# Altium project Wearables.PrjPcb
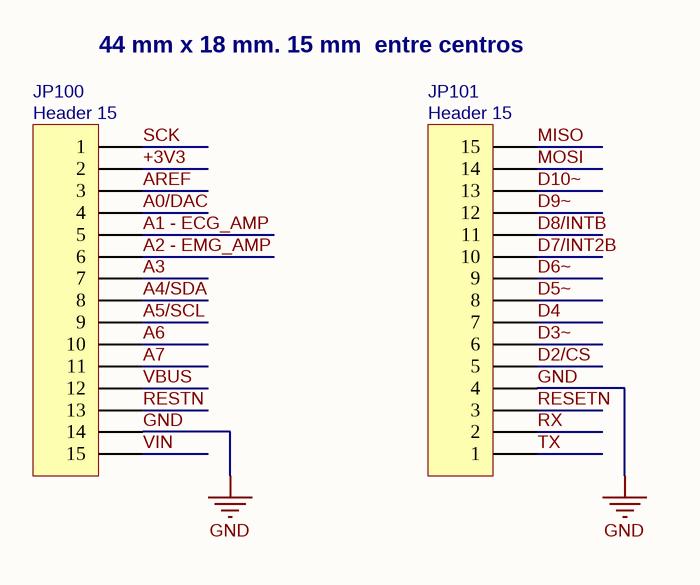
[diagram p0: Connectors.SchDoc]
5 sheets, 86 parts. Net scope: global (net labels, ports and power ports of the same name join across sheets).
Sheets:
  Connectors.SchDoc
  Power supply.SchDoc
  ECG_Chip.SchDoc
  EMG Amplifier.SchDoc
  Sensores.SchDoc

## Sheet Connectors.SchDoc
size A4; Organization: Altium Limited; Address1: 3 Minna Close; Address2: Belrose; Address3: NSW 2085; Address4: Australia

### Parts
JP100  Header 15  [HDR1X15]
JP101  Header 15  [HDR1X15]

### Nets
+3V3: JP100.2
GND: JP100.14 JP101.4
A0/DAC: JP100.4
A1 - ECG_AMP: JP100.5
A2 - EMG_AMP: JP100.6
A3: JP100.7
A4/SDA: JP100.8
A5/SCL: JP100.9
A6: JP100.10
A7: JP100.11
AREF: JP100.3
D2/CS: JP101.5
D3~: JP101.6
D4: JP101.7
D5~: JP101.8
D6~: JP101.9
D7/INT2B: JP101.10
D8/INTB: JP101.11
D9~: JP101.12
D10~: JP101.13
MISO: JP101.15
MOSI: JP101.14
RESETN: JP101.3
RESTN: JP100.13
RX: JP101.2
SCK: JP100.1
TX: JP101.1
VBUS: JP100.12
VIN: JP100.15

### Notes on the sheet
- 44 mm x 18 mm. 15 mm  entre centros
- Title
- Size:
- Date:
- A4
- Number:
- Time:
- Revision:
- Sheet
- of
- File:

### Library data of the parts
JP100 JP101 = Header 15: Header, 15-Pin; LatestRevisionDate: 17-Jul-2002; LatestRevisionNote: Re-released for DXP Platform.; Publisher: Altium Limited

## Sheet Power supply.SchDoc
size A4; Organization: Altium Limited; Address1: 3 Minna Close; Address2: Belrose; Address3: NSW 2085; Address4: Australia
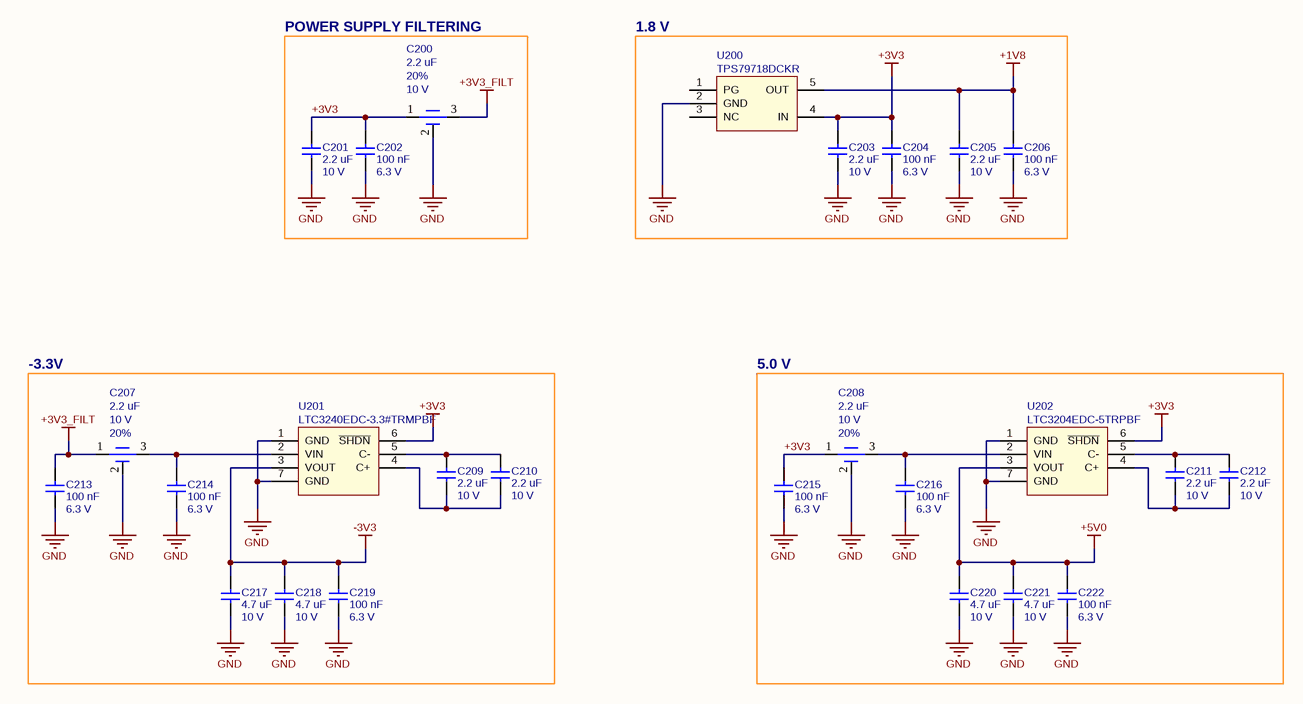
[diagram p1: Power supply.SchDoc]

### Parts
C200  value 2.2 uF  Tolerance: 20%  Voltage Max: 10 V  [NFC18PC - 0603]  (hidden comment: NFM18PC225B1A3)
C201  value 2.2 uF  Voltage Max: 10 V  [C0201]  (hidden comment: Capacitor no polarized)
C202  value 100 nF  Voltage Max: 6.3 V  [C0201]  (hidden comment: Capacitor no polarized)
C203  value 2.2 uF  Voltage Max: 10 V  [C0402]  (hidden comment: Capacitor no polarized)
C204  value 100 nF  Voltage Max: 6.3 V  [C0201]  (hidden comment: Capacitor no polarized)
C205  value 2.2 uF  Voltage Max: 10 V  [C0402]  (hidden comment: Capacitor no polarized)
C206  value 100 nF  Voltage Max: 6.3 V  [C0201]  (hidden comment: Capacitor no polarized)
C207  value 2.2 uF  Tolerance: 20%  Voltage Max: 10 V  [NFC18PC - 0603]  (hidden comment: NFM18PC225B1A3)
C208  value 2.2 uF  Tolerance: 20%  Voltage Max: 10 V  [NFC18PC - 0603]  (hidden comment: NFM18PC225B1A3)
C209  value 2.2 uF  Voltage Max: 10 V  [C0201]  (hidden comment: Capacitor no polarized)
C210  value 2.2 uF  Voltage Max: 10 V  [C0201]  (hidden comment: Capacitor no polarized)
C211  value 2.2 uF  Voltage Max: 10 V  [C0201]  (hidden comment: Capacitor no polarized)
C212  value 2.2 uF  Voltage Max: 10 V  [C0201]  (hidden comment: Capacitor no polarized)
C213  value 100 nF  Voltage Max: 6.3 V  [C0201]  (hidden comment: Capacitor no polarized)
C214  value 100 nF  Voltage Max: 6.3 V  [C0201]  (hidden comment: Capacitor no polarized)
C215  value 100 nF  Voltage Max: 6.3 V  [C0201]  (hidden comment: Capacitor no polarized)
C216  value 100 nF  Voltage Max: 6.3 V  [C0201]  (hidden comment: Capacitor no polarized)
C217  value 4.7 uF  Voltage Max: 10 V  [C0402]  (hidden comment: Capacitor no polarized)
C218  value 4.7 uF  Voltage Max: 10 V  [C0402]  (hidden comment: Capacitor no polarized)
C219  value 100 nF  Voltage Max: 6.3 V  [C0201]  (hidden comment: Capacitor no polarized)
C220  value 4.7 uF  Voltage Max: 10 V  [C0402]  (hidden comment: Capacitor no polarized)
C221  value 4.7 uF  Voltage Max: 10 V  [C0402]  (hidden comment: Capacitor no polarized)
C222  value 100 nF  Voltage Max: 6.3 V  [C0201]  (hidden comment: Capacitor no polarized)
U200  Reference: TPS79718DCKR  [5-SC70]  (hidden comment: TPS79718DCK)
U201  Reference: LTC3240EDC-3.3#TRMPBF  [DFN-6_DC]  (hidden comment: LTC3204-5)
U202  Reference: LTC3204EDC-5TRPBF  [DFN-6_DC]  (hidden comment: LTC3204-5)

### Blocks framed on the sheet
POWER SUPPLY FILTERING: C200-C202
1.8 V: C203-C206 U200
-3.3V: C207 C209 C210 C213 C214 C217-C219 U201
5.0 V: C208 C211 C212 C215 C216 C220-C222 U202

### Nets
+1V8: C205.2 C206.2 U200.5(OUT)
+3V3: C200.1(IN) C201.2 C202.2 C203.2 C204.2 C208.1(IN) C215.2 U200.4(IN) U201.6(~{SHDN}) U202.6(~{SHDN})
+3V3_FILT: C200.3(OUT) C207.1(IN) C213.2
+5V0: C220.2 C221.2 C222.2 U202.3(VOUT)
-3V3: C217.2 C218.2 C219.2 U201.3(VOUT)
GND: C200.2(GND) C201.1 C202.1 C203.1 C204.1 C205.1 C206.1 C207.2(GND) C208.2(GND) C213.1 C214.1 C215.1 C216.1 C217.1 C218.1 C219.1 C220.1 C221.1 C222.1 U200.2(GND) U201.1(GND) U201.7(GND) U202.1(GND) U202.7(GND)
NetC207_3: C207.3(OUT) C214.2 U201.2(VIN)
NetC208_3: C208.3(OUT) C216.2 U202.2(VIN)
NetC209_1: C209.1 C210.1 U201.4(C+)
NetC209_2: C209.2 C210.2 U201.5(C-)
NetC211_1: C211.1 C212.1 U202.4(C+)
NetC211_2: C211.2 C212.2 U202.5(C-)

Not connected (* = marked no-connect by the designer): U200 1(PG) 3(NC)

### Notes on the sheet
- Title
- Size:
- Date:
- A4
- Number:
- Time:
- Revision:
- Sheet
- of
- File:

### Library data of the parts
C200 C207 C208 = NFM18PC225B1A3: 3 Terminal Low ESL Chip Multilayer Ceramic Capacitor; Manufacturer: Murata; Current Max: 4 A; ESR: 0.01 Ohm; Component URL: https://psearch.en.murata.com/capacitor/product/NFM18PC225B1A3%23.html?excid=ww_pa-o_ow_ctl_c02e-21_2017; Dielectric: *; Package: 0603; Package Description: 3 Lead capacitor; Power Max: *; Supplier 1: Mouser; Supplier 1 Part Number: 81-NFM18PC225B1A3D; Supplier 2: Farnell; Supplier 2 Part Number: 2470495; Supplier 3: Digikey; Supplier 3 Part Number: 490-6972-1-ND; Voltage Min: *; Voltage Typ: *; Reference: NFM18PC225B1A3
C201 C203 C205 C209-C212 = Capacitor no polarized: Generic Capacitor; Manufacturer: Murata; Dielectric: X5R; Tolerance: 10%; Reference: GRM033R61A225KE47D; Component URL: https://product.tdk.com/en/search/capacitor/ceramic/mlcc/info?part_no=C1608X5R0J156M080AC; Current Max: *; Package: 0201; Package Description: *; Power Max: *; Supplier 1: Mouser; Supplier 2: Farnell; Supplier 3: Digikey; Supplier 1 Part Number: 81-GRM033R61A225KE7D; Supplier 2 Part Number: 3581639; Supplier 3 Part Number: 490-13227-1-ND; ESR: *; Voltage Min: *; Voltage Typ: *
C202 C204 C206 C213-C216 C219 C222 = Capacitor no polarized: Generic Capacitor; Manufacturer: Murata; Dielectric: X5R; Tolerance: 10%; Reference: GMD033R60J104KE11D; Component URL: https://product.tdk.com/en/search/capacitor/ceramic/mlcc/info?part_no=C1608X5R0J156M080AC; Current Max: *; Package: 0201; Package Description: *; Power Max: *; Supplier 1: Mouser; Supplier 2: Farnell; Supplier 3: Digikey; Supplier 1 Part Number: 81-GMD033R60J104KE1D; Supplier 2 Part Number: 1657913; Supplier 3 Part Number: 490-14513-1-ND; ESR: *; Voltage Min: *; Voltage Typ: *
C217 C218 C220 C221 = Capacitor no polarized: Generic Capacitor; Manufacturer: Murata; Dielectric: X5R; Tolerance: 10%; Reference: ZRB157R61A225KE11D; Component URL: https://product.tdk.com/en/search/capacitor/ceramic/mlcc/info?part_no=C1608X5R0J156M080AC; Current Max: *; Package: 0402; Package Description: *; Power Max: *; Supplier 1: Mouser; Supplier 2: Farnell; Supplier 3: Digikey; Supplier 1 Part Number: 81-ZRB157R61A225KE11D; Supplier 2 Part Number: 2990838; Supplier 3 Part Number: 490-10980-1-ND; ESR: *; Voltage Min: *; Voltage Typ: *
U200 = TPS79718DCK: Ultra-low Iq 50-mA low-dropout linear regulator with power good output in SC-70 package; Manufacturer: Texas Instruments; Voltage Max: 5.5 V; Voltage Min: 1.8 V; Current Max: 0.100 A; Component URL: https://www.ti.com/store/ti/en/p/product/?p=TPS79718DCKR&keyMatch=TPS79718DCKR&tisearch=Search-EN-everything&usecase=OPN; Supplier 1: Mouser; Supplier 2: Farnell; Supplier 3: Digikey; Supplier 1 Part Number: 595-TPS79718DCKR; Supplier 2 Part Number: 1575753; Supplier 3 Part Number: 296-11988-1-ND; Voltage Typ: *; Value: *; Tolerance: *; Footprint Description: 5-Lead Small; ESR: *; Power Max: *
U201 U202 = LTC3204-5: Low noise regulated charge pump in 2 x 2 DFN; Manufacturer: Analog Devices; Current Max: 0.150 A; Voltage Max: 5.5 V; Voltage Min: 2.7 V; ESR: *; Footprint: 6-DFN; Footprint Description: 6-Lead Plastic DFN; Supplier 1: Mouser; Supplier 2: Farnell; Supplier 3: Digikey; Voltage Typ: *; Tolerance: *; Value: *; Power Max: *
  U201: Component URL: https://www.analog.com/en/products/ltc3240.html; Supplier 1 Part Number: 584-C3240EDC-3.3TMPF; Supplier 2 Part Number: 1715233; Supplier 3 Part Number: LTC3240EDC-3.3#TRMPBFCT-ND
  U202: Component URL: https://www.analog.com/en/products/ltc3204.html; Supplier 1 Part Number: 584-C3204EDC-5TRPBF; Supplier 2 Part Number: *; Supplier 3 Part Number: LTC3204EDC-5#TRPBF-ND

## Sheet ECG_Chip.SchDoc
size A4; Organization: Altium Limited; Address1: 3 Minna Close; Address2: Belrose; Address3: NSW 2085; Address4: Australia
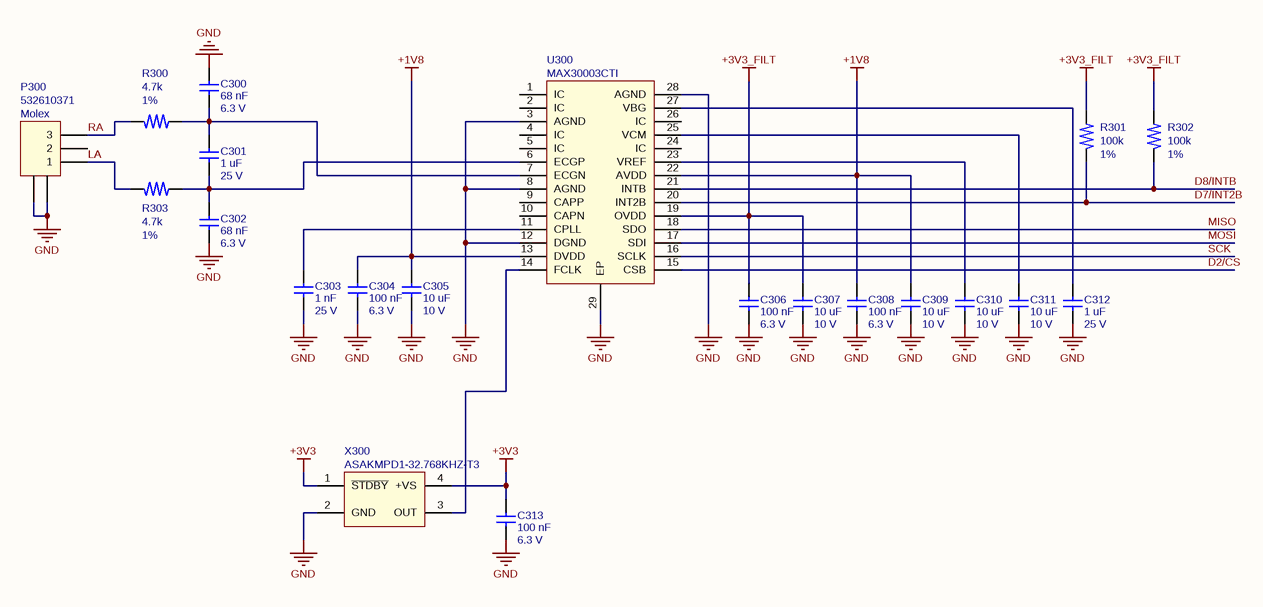
[diagram p2: ECG_Chip.SchDoc]

### Parts
C300  value 68 nF  Voltage Max: 6.3 V  [C0201]  (hidden comment: Capacitor no polarized)
C301  value 1 uF  Voltage Max: 25 V  [C0201]  (hidden comment: Capacitor no polarized)
C302  value 68 nF  Voltage Max: 6.3 V  [C0201]  (hidden comment: Capacitor no polarized)
C303  value 1 nF  Voltage Max: 25 V  [C0201]  (hidden comment: Capacitor no polarized)
C304  value 100 nF  Voltage Max: 6.3 V  [C0201]  (hidden comment: Capacitor no polarized)
C305  value 10 uF  Voltage Max: 10 V  [C0402]  (hidden comment: Capacitor no polarized)
C306  value 100 nF  Voltage Max: 6.3 V  [C0201]  (hidden comment: Capacitor no polarized)
C307  value 10 uF  Voltage Max: 10 V  [C0402]  (hidden comment: Capacitor no polarized)
C308  value 100 nF  Voltage Max: 6.3 V  [C0201]  (hidden comment: Capacitor no polarized)
C309  value 10 uF  Voltage Max: 10 V  [C0402]  (hidden comment: Capacitor no polarized)
C310  value 10 uF  Voltage Max: 10 V  [C0402]  (hidden comment: Capacitor no polarized)
C311  value 10 uF  Voltage Max: 10 V  [C0402]  (hidden comment: Capacitor no polarized)
C312  value 1 uF  Voltage Max: 25 V  [C0603]  (hidden comment: Capacitor no polarized)
C313  value 100 nF  Voltage Max: 6.3 V  [C0201]  (hidden comment: Capacitor no polarized)
P300  Manufacturer: Molex  [532610371]  (hidden comment: 532610471)
R300  value 4.7k  Tolerance: 1%  [R0201]  (hidden comment: R)
R301  value 100k  Tolerance: 1%  [R0201]  (hidden comment: R)
R302  value 100k  Tolerance: 1%  [R0201]  (hidden comment: R)
R303  value 4.7k  Tolerance: 1%  [R0201]  (hidden comment: R)
U300  AD8629ARMZ  [TQFN-28_5_5]  (value not drawn)
X300  Reference: ASAKMPD1-32.768KHZ-T3  [XTAL-16_12]  (hidden comment: LFSPXO071945Cutt)

### Nets
+1V8: C304.2 C305.2 C308.2 C309.2 U300.13(DVDD) U300.22(AVDD)
+3V3: C313.2 X300.1(~{STDBY}) X300.4(+VS)
+3V3_FILT: C306.2 C307.2 R301.1 R302.1 U300.19(OVDD)
GND: C300.1 C302.2 C303.2 C304.1 C305.1 C306.1 C307.1 C308.1 C309.1 C310.1 C311.1 C312.2 C313.1 P300.0 U300.3(AGND) U300.8(AGND) U300.12(DGND) U300.28(AGND) U300.29(EP) X300.2(GND)
D2/CS: U300.15(CSB)
D7/INT2B: R301.2 U300.20(INT2B)
D8/INTB: R302.2 U300.21(INTB)
LA: P300.1 R303.2
MISO: U300.18(SDO)
MOSI: U300.17(SDI)
RA: P300.3 R300.2
SCK: U300.16(SCLK)
NetC300_2: C300.2 C301.1 R300.1 U300.7(ECGN)
NetC301_2: C301.2 C302.1 R303.1 U300.6(ECGP)
NetC303_1: C303.1 U300.11(CPLL)
NetC310_2: C310.2 U300.23(VREF)
NetC311_2: C311.2 U300.25(VCM)
NetC312_1: C312.1 U300.27(VBG)
NetU300_14: U300.14(FCLK) X300.3(OUT)

Not connected (* = marked no-connect by the designer): P300 2; U300 1(IC) 2(IC) 4(IC) 5(IC) 9(CAPP) 10(CAPN) 24(IC) 26(IC)

### Notes on the sheet
- Title
- Size:
- Date:
- A4
- Number:
- Time:
- Revision:
- Sheet
- of
- File:

### Library data of the parts
C300 C302 = Capacitor no polarized: Generic Capacitor; Manufacturer: TDK; Dielectric: X5R; Tolerance: 10%; Reference: GRM033R60J683KE19D; Current Max: *; Package: 0201; Package Description: *; Power Max: *; Supplier 1: Mouser; Supplier 2: Farnell; Supplier 3: Digikey; Supplier 1 Part Number: 81-GRM033R60J683KE9D; Supplier 2 Part Number: 2999215; Supplier 3 Part Number: 490-3171-1-ND; ESR: *; Voltage Min: *; Voltage Typ: *
C301 C312 = Capacitor no polarized: Generic Capacitor; Manufacturer: Murata; Dielectric: X5R; Tolerance: 10%; Reference: GRM155R61E105KA12D; Current Max: *; Package: 0402; Package Description: *; Power Max: *; Supplier 1: Mouser; Supplier 2: Farnell; Supplier 3: Digikey; Supplier 1 Part Number: 81-GRM155R61E105KA12J; Supplier 2 Part Number: 2218855; Supplier 3 Part Number: 490-10017-1-ND; ESR: *; Voltage Min: *; Voltage Typ: *
C303 = Capacitor no polarized: Generic Capacitor; Manufacturer: Murata; Dielectric: X7R; Tolerance: 10%; Reference: GRM033R71E102KA01D; Current Max: *; Package: 0201; Package Description: *; Power Max: *; Supplier 1: Mouser; Supplier 2: Farnell; Supplier 3: Digikey; Supplier 1 Part Number: 81-GRM033R71E102KA1D; Supplier 2 Part Number: 1776006; Supplier 3 Part Number: 490-3184-1-ND; ESR: *; Voltage Min: *; Voltage Typ: *
C304 C306 C308 C313 = Capacitor no polarized: as C202 on sheet Power supply; Component URL: https://product.tdk.com/en/search/capacitor/ceramic/mlcc/info?part_no=C1608X5R0J156M080AC; Current Max: *; Package: 0201; Package Description: *; Power Max: *; Supplier 1: Mouser; Supplier 2: Farnell; Supplier 3: Digikey; Supplier 1 Part Number: 81-GMD033R60J104KE1D; Supplier 2 Part Number: 1657913; Supplier 3 Part Number: 490-14513-1-ND; ESR: *; Voltage Min: *; Voltage Typ: *
C305 C307 C309-C311 = Capacitor no polarized: Generic Capacitor; Manufacturer: AVX; Dielectric: X5R; Tolerance: 20%; Reference: 0402ZD106MAT2A; Component URL: https://product.tdk.com/en/search/capacitor/ceramic/mlcc/info?part_no=C1608X5R0J156M080AC; Current Max: *; Package: 0402; Package Description: *; Power Max: *; Supplier 1: Mouser; Supplier 2: Farnell; Supplier 3: Digikey; Supplier 1 Part Number: 581-0402ZD106MAT2A; Supplier 2 Part Number: 3340826; Supplier 3 Part Number: 478-10052-1-ND; ESR: *; Voltage Min: *; Voltage Typ: *
P300 = 532610371: 1.25mm Pitch, PicoBlade PCB Header, Single Row, Right-Angle, Surface Mount, Tin (Sn) Plating, Friction Lock, 3 Circuits, Tape and Reel; Voltage Max: 125 V; Component URL: https://www.molex.com/molex/products/part-detail/pcb_headers/0532610371; Footprint: *; Footprint Description: *; Power Max: *; Supplier 1: Mouser; Supplier 2: Farnell; Supplier 3: Digikey; Supplier 1 Part Number: 538-53261-0371; Supplier 2 Part Number: 1125359; Supplier 3 Part Number: WM7621CT-ND; Tolerance: *; Value: *; Voltage Min: *; Voltage Typ: *; Reference: 532610371; ESR: *; Current Max: *
R300 R303 = R: Generic Resistor; Manufacturer: VISHAY/DALE; Power Max: 0.050 W; Reference: CRCW02014K70FKED; Voltage Max: 30 V; Component URL: *; Current Max: *; Dielectric: *; Package: 0201; Package Description: *; Supplier 1: Mouser; Supplier 2: Farnell; Supplier 3: Digikey; Supplier 1 Part Number: 791-WR04X4701FTL; Supplier 2 Part Number: 2906613; Supplier 3 Part Number: 541-4.70KAABCT-ND; Voltage Min: *; Voltage Typ: *; ESR: *
R301 R302 = R: Generic Resistor; Manufacturer: VISHAY/DALE; Power Max: 0.0050 W; Reference: CRCW0201100KFKED; Voltage Max: 30 V; Component URL: *; Current Max: *; Dielectric: *; Package: 0201; Package Description: *; Supplier 1: Mouser; Supplier 2: Farnell; Supplier 3: Digikey; Supplier 1 Part Number: 71-CRCW0201100KFKED; Supplier 2 Part Number: 2616720; Supplier 3 Part Number: 541-100KAABCT-ND; Voltage Min: *; Voltage Typ: *; ESR: *
U300 = MAX30003CTI: Ultra-Low Power, Single-Channel Integrated  Biopotential (ECG, R-to-R Detection) AFE; Manufacturer: Maxim Integrated; Voltage Max: 3.6 V; Component URL: *; Supplier 1: Mouser; Supplier 2: Farnell; Supplier 3: Digikey; Supplier 1 Part Number: 700-MAX30003CTI+; Supplier 2 Part Number: 2668156; Supplier 3 Part Number: MAX30003CTI+TCT-ND; Tolerance: *; Value: *; Voltage Min: *; Voltage Typ: *; Power Max: *; ESR: *; Reference: MAX30003CTI; Current Max: *; Footprint: *; Footprint Description: *
X300 = LFSPXO071945Cutt: Crystal clock oscillator; Manufacturer: Abracon; Current Max: 0.025 A; Voltage Max: 3.6 V; Voltage Min: 3.0 V; Voltage Typ: 1.6 V; Component URL: *; ESR: *; Power Max: *; Supplier 1: Mouser; Supplier 2: Farnell; Supplier 3: Digikey; Supplier 1 Part Number: 815-ASAKMPD1-32.768T; Supplier 2 Part Number: 2920073; Supplier 3 Part Number: 535-14677-1-ND; Tolerance: *; Value: *; Footprint: *; Footrprint Description: *

## Sheet EMG Amplifier.SchDoc
size A4; Organization: Altium Limited; Address1: 3 Minna Close; Address2: Belrose; Address3: NSW 2085; Address4: Australia
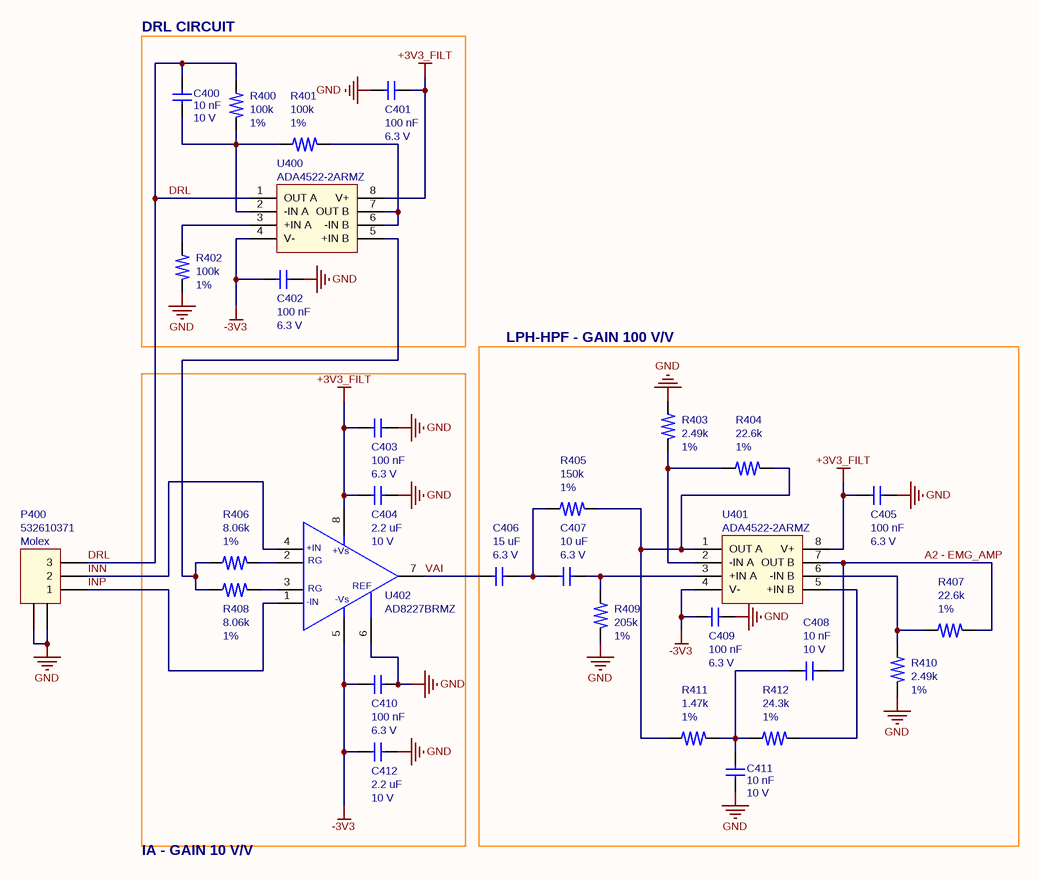
[diagram p3: EMG Amplifier.SchDoc]

### Parts
C400  value 10 nF  Voltage Max: 10 V  [C0201]  (hidden comment: Capacitor no polarized)
C401  value 100 nF  Voltage Max: 6.3 V  [C0201]  (hidden comment: Capacitor no polarized)
C402  value 100 nF  Voltage Max: 6.3 V  [C0201]  (hidden comment: Capacitor no polarized)
C403  value 100 nF  Voltage Max: 6.3 V  [C0201]  (hidden comment: Capacitor no polarized)
C404  value 2.2 uF  Voltage Max: 10 V  [C0201]  (hidden comment: Capacitor no polarized)
C405  value 100 nF  Voltage Max: 6.3 V  [C0201]  (hidden comment: Capacitor no polarized)
C406  value 15 uF  Voltage Max: 6.3 V  [C0402]  (hidden comment: Capacitor no polarized)
C407  value 10 uF  Voltage Max: 6.3 V  [C0402]  (hidden comment: Capacitor no polarized)
C408  value 10 nF  Voltage Max: 10 V  [C0201]  (hidden comment: Capacitor no polarized)
C409  value 100 nF  Voltage Max: 6.3 V  [C0201]  (hidden comment: Capacitor no polarized)
C410  value 100 nF  Voltage Max: 6.3 V  [C0201]  (hidden comment: Capacitor no polarized)
C411  value 10 nF  Voltage Max: 10 V  [C0201]  (hidden comment: Capacitor no polarized)
C412  value 2.2 uF  Voltage Max: 10 V  [C0201]  (hidden comment: Capacitor no polarized)
P400  Manufacturer: Molex  [532610371]  (hidden comment: 532610371)
R400  value 100k  Tolerance: 1%  [R0201]  (hidden comment: R)
R401  value 100k  Tolerance: 1%  [R0201]  (hidden comment: R)
R402  value 100k  Tolerance: 1%  [R0201]  (hidden comment: R)
R403  value 2.49k  Tolerance: 1%  [R0201]  (hidden comment: R)
R404  value 22.6k  Tolerance: 1%  [R0201]  (hidden comment: R)
R405  value 150k  Tolerance: 1%  [R0201]  (hidden comment: R)
R406  value 8.06k  Tolerance: 1%  [R0201]  (hidden comment: R)
R407  value 22.6k  Tolerance: 1%  [R0201]  (hidden comment: R)
R408  value 8.06k  Tolerance: 1%  [R0201]  (hidden comment: R)
R409  value 205k  Tolerance: 1%  [R0201]  (hidden comment: R)
R410  value 2.49k  Tolerance: 1%  [R0201]  (hidden comment: R)
R411  value 1.47k  Tolerance: 1%  [R0201]  (hidden comment: R)
R412  value 24.3k  Tolerance: 1%  [R0201]  (hidden comment: R)
U400  ADA4522-2ARMZ  [8-MSOP]
U401  ADA4522-2ARMZ  [8-MSOP]
U402  AD8227BRMZ  [8-MSOP]

### Blocks framed on the sheet
DRL CIRCUIT: C400-C402 R400-R402 U400
LPH-HPF - GAIN 100 V/V: C405-C409 C411 R403-R405 R407 R409-R412 U401

### Nets
+3V3_FILT: C401.2 C403.2 C404.2 C405.2 U400.8(V+) U401.8(V+) U402.8(+Vs)
-3V3: C402.2 C409.2 C410.2 C412.2 U400.4(V-) U401.4(V-) U402.5(-Vs)
GND: C401.1 C402.1 C403.1 C404.1 C405.1 C409.1 C410.1 C411.1 C412.1 P400.0 R402.2 R403.1 R409.2 R410.2 U402.6(REF)
A2 - EMG_AMP: C408.2 R407.2 U401.7(OUT_B)
DRL: C400.2 P400.3 R400.1 U400.1(OUT_A)
INN: P400.2 U402.4(+IN)
INP: P400.1 U402.1(+IN)
VAI: C406.2 U402.7(OUT)
NetC400_1: C400.1 R400.2 R401.1 U400.2(-IN_A)
NetC406_1: C406.1 C407.2 R405.1
NetC407_1: C407.1 R409.1 U401.3(+IN_A)
NetC408_1: C408.1 C411.2 R411.2 R412.1
NetR401_2: R401.2 U400.6(-IN_B) U400.7(OUT_B)
NetR402_1: R402.1 U400.3(+IN_A)
NetR403_2: R403.2 R404.1 U401.2(-IN_A)
NetR404_2: R404.2 R405.2 R411.1 U401.1(OUT_A)
NetR406_1: R406.1 R408.1 U400.5(+IN_B)
NetR406_2: R406.2 U402.2(RG)
NetR407_1: R407.1 R410.1 U401.6(-IN_B)
NetR408_2: R408.2 U402.3(RG)
NetR412_2: R412.2 U401.5(+IN_B)

### Notes on the sheet
- IA - GAIN 10 V/V
- Title
- Size:
- Date:
- A4
- Number:
- Time:
- Revision:
- Sheet
- of
- File:
- (in symbol AD8227BRMZ) -IN

### Library data of the parts
C400 C408 C411 = Capacitor no polarized: Generic Capacitor; Manufacturer: Murata; Dielectric: X7R; Tolerance: 10%; Reference: GRM033R71A103KA01D; Component URL: https://www.murata.com/en-eu/products/productdetail?partno=GRM033R71A103KA01%23; Current Max: *; Package: 0201; Package Description: *; Power Max: *; Supplier 1: Mouser; Supplier 2: Farnell; Supplier 3: Digikey; Supplier 1 Part Number: 81-GRM033R71A103KA1D; Supplier 2 Part Number: 1776000; Supplier 3 Part Number: 490-3194-1-ND; ESR: *; Voltage Min: *; Voltage Typ: *
C401-C403 C405 C409 C410 = Capacitor no polarized: as C202 on sheet Power supply; Component URL: https://product.tdk.com/en/search/capacitor/ceramic/mlcc/info?part_no=C1608X5R0J156M080AC; Current Max: *; Package: 0201; Package Description: *; Power Max: *; Supplier 1: Mouser; Supplier 2: Farnell; Supplier 3: Digikey; Supplier 1 Part Number: 81-GMD033R60J104KE1D; Supplier 2 Part Number: 1657913; Supplier 3 Part Number: 490-14513-1-ND; ESR: *; Voltage Min: *; Voltage Typ: *
C404 C412 = Capacitor no polarized: as C201 on sheet Power supply; Component URL: https://product.tdk.com/en/search/capacitor/ceramic/mlcc/info?part_no=C1608X5R0J156M080AC; Current Max: *; Package: 0201; Package Description: *; Power Max: *; Supplier 1: Mouser; Supplier 2: Farnell; Supplier 3: Digikey; Supplier 1 Part Number: 81-GRM033R61A225KE7D; Supplier 2 Part Number: 3581639; Supplier 3 Part Number: 490-13227-1-ND; ESR: *; Voltage Min: *; Voltage Typ: *
C406 = Capacitor no polarized: Generic Capacitor; Manufacturer: Murata; Dielectric: X5R; Tolerance: 20%; Reference: GRM155R60J156ME05D; Component URL: https://www.murata.com/en-eu/products/productdetail?partno=GRM155R60J156ME05%23; Current Max: *; Package: 0402; Package Description: *; Power Max: *; Supplier 1: Mouser; Supplier 2: Farnell; Supplier 3: Digikey; Supplier 1 Part Number: 81-GRM155R60J156ME5D; Supplier 2 Part Number: 3581354; Supplier 3 Part Number: 490-18659-1-ND; ESR: *; Voltage Min: *; Voltage Typ: *
C407 = Capacitor no polarized: Generic Capacitor; Manufacturer: Murata; Dielectric: X5R; Tolerance: 20%; Reference: GRJ155R60J106ME11D; Component URL: https://www.murata.com/en-eu/products/productdetail?partno=GRJ155R60J106ME11%23; Current Max: *; Package: 0402; Package Description: *; Power Max: *; Supplier 1: Mouser; Supplier 2: Farnell; Supplier 3: Digikey; Supplier 1 Part Number: 81-GRJ155R60J106ME1D; Supplier 2 Part Number: 3581611; Supplier 3 Part Number: 490-13211-1-ND; ESR: *; Voltage Min: *; Voltage Typ: *
P400 = 532610371: as P300 on sheet ECG_Chip; Component URL: https://www.molex.com/molex/products/part-detail/pcb_headers/0532610371; Footprint: *; Footprint Description: *; Power Max: *; Supplier 1: Mouser; Supplier 2: Farnell; Supplier 3: Digikey; Supplier 1 Part Number: 538-53261-0371; Supplier 2 Part Number: 1125359; Supplier 3 Part Number: WM7621CT-ND; Tolerance: *; Value: *; Voltage Min: *; Voltage Typ: *; Reference: 532610371
R400-R402 = R: as R301 on sheet ECG_Chip; Component URL: *; Current Max: *; Dielectric: *; Package: 0201; Package Description: *; Supplier 1: Mouser; Supplier 2: Farnell; Supplier 3: Digikey; Supplier 1 Part Number: 71-CRCW0201100KFKED; Supplier 2 Part Number: 2616720; Supplier 3 Part Number: 541-100KAABCT-ND; Voltage Min: *; Voltage Typ: *; ESR: *
R403 R410 = R: Generic Resistor; Manufacturer: VISHAY/DALE; Power Max: 0.050 W; Reference: CRCW02012K49FKED; Voltage Max: 30 V; Component URL: *; Current Max: *; Dielectric: *; Package: 0201; Package Description: *; Supplier 1: Mouser; Supplier 2: Farnell; Supplier 3: Digikey; Supplier 1 Part Number: 71-CRCW02012K49FKED; Supplier 2 Part Number: 2838900; Supplier 3 Part Number: 541-2.49KAABCT-ND; Voltage Min: *; Voltage Typ: *; ESR: *
R404 R407 = R: Generic Resistor; Manufacturer: VISHAY/DALE; Power Max: 0.050 W; Reference: CRCW020122K6FKED; Voltage Max: 30 V; Component URL: *; Current Max: *; Dielectric: *; Package: 0201; Package Description: *; Supplier 1: Mouser; Supplier 2: Farnell; Supplier 3: Digikey; Supplier 1 Part Number: 71-CRCW020122K6FKED; Supplier 3 Part Number: 541-22.6KAABCT-ND; Voltage Min: *; Voltage Typ: *; ESR: *
R405 = R: Generic Resistor; Manufacturer: VISHAY/DALE; Power Max: 0.050 W; Reference: CRCW0201150KFKED; Voltage Max: 30 V; Component URL: *; Current Max: *; Dielectric: *; Package: 0201; Package Description: *; Supplier 1: Mouser; Supplier 2: Farnell; Supplier 3: Digikey; Supplier 1 Part Number: 71-CRCW0201150KFKED; Supplier 2 Part Number: 2302394; Supplier 3 Part Number: 541-2943-1-ND; Voltage Min: *; Voltage Typ: *; ESR: *
R406 R408 = R: Generic Resistor; Manufacturer: VISHAY/DALE; Power Max: 0.050 W; Reference: CRCW02018K06FNED; Voltage Max: 30 V; Component URL: *; Current Max: *; Dielectric: *; Package: 0201; Package Description: *; Supplier 1: Mouser; Supplier 2: Farnell; Supplier 3: Digikey; Supplier 1 Part Number: 71-CRCW02018K06FNED; Supplier 2 Part Number: 1851382; Supplier 3 Part Number: 541-CRCW02018K06FNEDCT-ND; Voltage Min: *; Voltage Typ: *; ESR: *
R409 = R: Generic Resistor; Manufacturer: VISHAY/DALE; Power Max: 0.050 W; Reference: CRCW0201205KFKED; Voltage Max: 30 V; Component URL: *; Current Max: *; Dielectric: *; Package: 0201; Package Description: *; Supplier 1: Mouser; Supplier 2: Farnell; Supplier 3: Digikey; Supplier 1 Part Number: 71-CRCW0201205KFKED; Supplier 2 Part Number: 1851000; Supplier 3 Part Number: CRCW0201205KFKED-ND; Voltage Min: *; Voltage Typ: *; ESR: *
R411 = R: Generic Resistor; Manufacturer: VISHAY/DALE; Power Max: 0.050 W; Reference: CRCW02011K47FKED; Voltage Max: 30 V; Component URL: *; Current Max: *; Dielectric: *; Package: 0201; Package Description: *; Supplier 1: Mouser; Supplier 2: Farnell; Supplier 3: Digikey; Supplier 1 Part Number: 71-CRCW02011K47FKED; Supplier 3 Part Number: 541-1.47KAABCT-ND; Voltage Min: *; Voltage Typ: *; ESR: *
R412 = R: Generic Resistor; Manufacturer: VISHAY/DALE; Power Max: 0.050 W; Reference: CRCW020124K3FKED; Voltage Max: 30 V; Component URL: *; Current Max: *; Dielectric: *; Package: 0201; Package Description: *; Supplier 1: Mouser; Supplier 2: Farnell; Supplier 3: Digikey; Supplier 1 Part Number: 71-CRCW020124K3FKED; Supplier 3 Part Number: CRCW020124K3FKED-ND; Voltage Min: *; Voltage Typ: *; ESR: *
U400 U401 = ADA4522-2ARMZ: Dual 55V, EMI Enhanced, Zero Drift, Ultralow Noise, Rail-to-Rail Output Operational Amplifiers; Manufacturer: Analog Devices; Current Max: 0.0009 A; Voltage Max: 55.0 V; Voltage Min: 4.5 V; Component URL: https://www.analog.com/en/products/ada4522-2.html; Dielectric: *; ESR: *; Package: 8-MSOP; Package Description: 8 Lead MSOP; Supplier 1: Mouser; Supplier 2: Farnell; Supplier 3: Digikey; Supplier 1 Part Number: 584-ADA4522-2ARMZ; Supplier 2 Part Number: 2725070; Supplier 3 Part Number: ADA4522-2ARMZ-ND; Tolerance: *; Value: *; Voltage Typ: *; Reference: ADA4522-2ARMZ
U402 = AD8227BRMZ: Wide Supply Range, Rail-to-Rail  Output Instrumentation Amplifier; Manufacturer: Analog Devices; Current Max: 0.6 mA; Voltage Max: 36.0 V; Voltage Min: 2.2 V; Component URL: https://www.analog.com/media/en/technical-documentation/data-sheets/AD8227.pdf; ESR: *; Footprint Description: *; Power Max: *; Supplier 1: Mouser; Supplier 2: Farnell; Supplier 3: Digikey; Supplier 1 Part Number: 584-AD8227BRMZ; Supplier 2 Part Number: 2462028; Supplier 3 Part Number: AD8227BRMZ-ND; Tolerance: *; Value: *; Voltage Typ: *; Reference: AD8227BRMZ

## Sheet Sensores.SchDoc
size A4; Organization: Altium Limited; Address1: 3 Minna Close; Address2: Belrose; Address3: NSW 2085; Address4: Australia
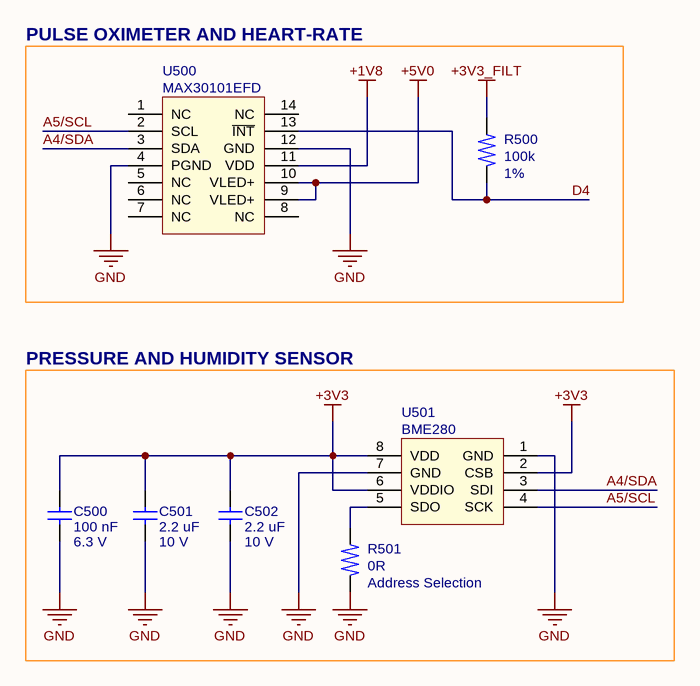
[diagram p4: Sensores.SchDoc]

### Parts
C500  value 100 nF  Voltage Max: 6.3 V  [C0201]  (hidden comment: Capacitor no polarized)
C501  value 2.2 uF  Voltage Max: 10 V  [C0201]  (hidden comment: Capacitor no polarized)
C502  value 2.2 uF  Voltage Max: 10 V  [C0201]  (hidden comment: Capacitor no polarized)
R500  value 100k  Tolerance: 1%  [R0201]  (hidden comment: R)
R501  value 0R  [R0201]  (hidden comment: R)
U500  MAX30101EFD  [OLGA-14]
U501  BME280  [8-LGA_2X5_2X5]

### Blocks framed on the sheet
PULSE OXIMETER AND HEART-RATE: R500 U500
PRESSURE AND HUMIDITY SENSOR: C500-C502 R501 U501

### Nets
+1V8: U500.11(VDD)
+3V3: C500.2 C501.2 C502.2 U501.2(CSB) U501.6(VDDIO) U501.8(VDD)
+3V3_FILT: R500.1
+5V0: U500.9(VLED+) U500.10(VLED+)
GND: C500.1 C501.1 C502.1 R501.2 U500.4(PGND) U500.12(GND) U501.1(GND) U501.7(GND)
A4/SDA: U500.3(SDA) U501.3(SDI)
A5/SCL: U500.2(SCL) U501.4(SCK)
D4: R500.2 U500.13(~{INT})
NetR501_1: R501.1 U501.5(SDO)

Not connected (* = marked no-connect by the designer): U500 1(NC) 5(NC) 6(NC) 7(NC) 8(NC) 14(NC)

### Notes on the sheet
- (near R501) Address Selection
- Title
- Size:
- Date:
- A4
- Number:
- Time:
- Revision:
- Sheet
- of
- File:

### Library data of the parts
C500 = Capacitor no polarized: as C202 on sheet Power supply; Component URL: https://product.tdk.com/en/search/capacitor/ceramic/mlcc/info?part_no=C1608X5R0J156M080AC; Current Max: *; Package: 0201; Package Description: *; Power Max: *; Supplier 1: Mouser; Supplier 2: Farnell; Supplier 3: Digikey; Supplier 1 Part Number: 81-GMD033R60J104KE1D; Supplier 2 Part Number: 1657913; Supplier 3 Part Number: 490-14513-1-ND; ESR: *; Voltage Min: *; Voltage Typ: *
C501 C502 = Capacitor no polarized: as C201 on sheet Power supply; Component URL: https://product.tdk.com/en/search/capacitor/ceramic/mlcc/info?part_no=C1608X5R0J156M080AC; Current Max: *; Package: 0201; Package Description: *; Power Max: *; Supplier 1: Mouser; Supplier 2: Farnell; Supplier 3: Digikey; Supplier 1 Part Number: 81-GRM033R61A225KE7D; Supplier 2 Part Number: 3581639; Supplier 3 Part Number: 490-13227-1-ND; ESR: *; Voltage Min: *; Voltage Typ: *
R500 = R: as R301 on sheet ECG_Chip; Component URL: *; Current Max: *; Dielectric: *; Package: 0201; Package Description: *; Supplier 1: Mouser; Supplier 2: Farnell; Supplier 3: Digikey; Supplier 1 Part Number: 71-CRCW0201100KFKED; Supplier 2 Part Number: 2616720; Supplier 3 Part Number: 541-100KAABCT-ND; Voltage Min: *; Voltage Typ: *; ESR: *
R501 = R: Generic Resistor; Manufacturer: Yageo; Power Max: 0.050 W; Tolerance: 0.1%; Reference: RC0201FR-070RL; Voltage Max: 25 V; Component URL: *; Current Max: *; Dielectric: *; Package: 0201; Package Description: *; Supplier 1: Mouser; Supplier 2: Farnell; Supplier 3: Digikey; Supplier 1 Part Number: 603-RC0201FR-070RL; Supplier 2 Part Number: 2139811; Supplier 3 Part Number: 311-0.0MCT-ND; Voltage Min: *; Voltage Typ: *; ESR: *
U500 = MAX30101EFD: High-Sensitivity Pulse Oximeter and  Heart-Rate Sensor for Wearable Health; Voltage Max: 6.0 V; Voltage Min: 1.8 V; component URL: https://www.maximintegrated.com/en/products/interface/sensor-interface/MAX30101.html/tb_tab2; Current Max: *; ESR: *; Footprint Description: 14-Lead Organic Land Grid Array; Power Max: *; Supplier 1: Mouser; Supplier 2: Farnell; Supplier 3: Digikey; Supplier 1 Part Number: 700-MAX30101EFD+; Supplier 2 Part Number: 2580783; Supplier 3 Part Number: MAX30101EFD+TCT-ND; Tolerance: *; Value: *; Voltage Typ: *; Reference: MAX30101EFD
U501 = BME280: Combined humidity and pressure sensor; Manufacturer: Bosch; Current Max: 0.000714 A; Voltage Max: 4.25 V; Voltage Min: 1.71 V; Component URL: https://www.bosch-sensortec.com/products/environmental-sensors/humidity-sensors-bme280/; ESR: *; Footprint: 8-LGA; Footprint Description: 8-Lead Land Grid Array; Power Max: *; Supplier 1: Mouser; Supplier 2: Farnell; Supplier 3: Digikey; Supplier 1 Part Number: 262-BME280; Supplier 2 Part Number: *; Supplier 3 Part Number: 828-1063-1-ND; Tolerance: *; Value: *; Voltage Typ: *; Reference: BME280

## Nets that join several sheets
+1V8: Power supply (C205.2 C206.2 U200.5), ECG_Chip (6 pins), Sensores (U500.11)
+3V3: Connectors (JP100.2), Power supply (10 pins), ECG_Chip (C313.2 X300.1 X300.4), Sensores (6 pins)
+3V3_FILT: Power supply (C200.3 C207.1 C213.2), ECG_Chip (5 pins), EMG Amplifier (7 pins), Sensores (R500.1)
+5V0: Power supply (C220.2 C221.2 C222.2 U202.3), Sensores (U500.9 U500.10)
-3V3: Power supply (C217.2 C218.2 C219.2 U201.3), EMG Amplifier (7 pins)
GND: Connectors (JP100.14 JP101.4), Power supply (24 pins), ECG_Chip (20 pins), EMG Amplifier (15 pins), Sensores (8 pins)
A2 - EMG_AMP: Connectors (JP100.6), EMG Amplifier (C408.2 R407.2 U401.7)
A4/SDA: Connectors (JP100.8), Sensores (U500.3 U501.3)
A5/SCL: Connectors (JP100.9), Sensores (U500.2 U501.4)
D2/CS: Connectors (JP101.5), ECG_Chip (U300.15)
D4: Connectors (JP101.7), Sensores (R500.2 U500.13)
D7/INT2B: Connectors (JP101.10), ECG_Chip (R301.2 U300.20)
D8/INTB: Connectors (JP101.11), ECG_Chip (R302.2 U300.21)
MISO: Connectors (JP101.15), ECG_Chip (U300.18)
MOSI: Connectors (JP101.14), ECG_Chip (U300.17)
SCK: Connectors (JP100.1), ECG_Chip (U300.16)